# Altium schematic sheet Reprogrammable Timer.SchDoc
size A; SheetNumber: 1; SheetTotal: 1
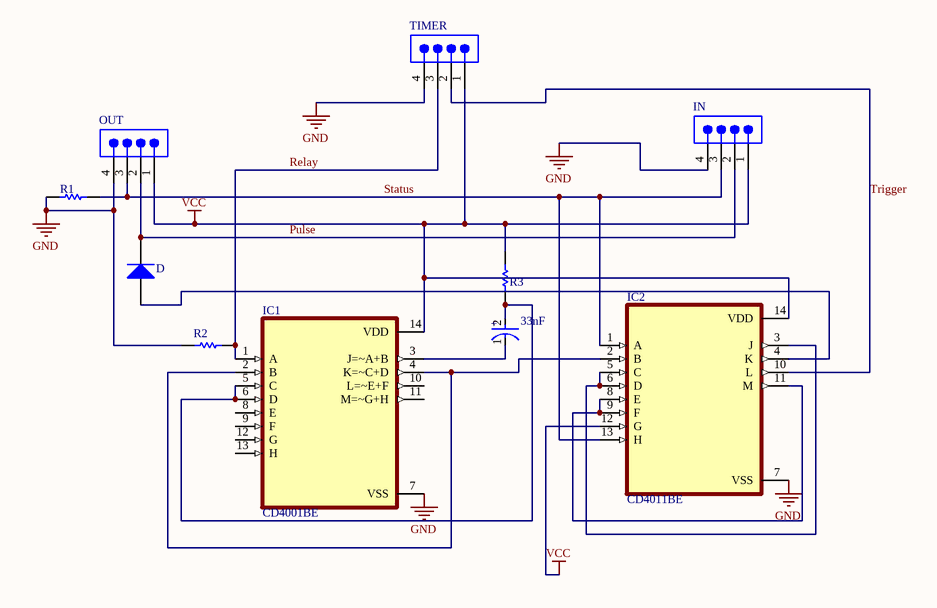
[diagram p0: Reprogrammable Timer.SchDoc]

## Parts
33nF  EEUHD1H330  [FP-RAD-TH-D_5_0_5-L_11_1-MFG]  (value not drawn)
D  1N4001-T  [DIOD-DO-41-P-2_V]  (value not drawn)
IC1  CD4001BE  [DIP794W45P254L1969H508Q14]
IC2  CD4011BE  [DIP794W45P254L1969H508Q14]
IN  TSW-104-08-L-S  [SMTC-TSW-104-08-X-S]  (value not drawn)
OUT  TSW-104-08-L-S  [SMTC-TSW-104-08-X-S]  (value not drawn)
R1  MFR-25FBF52-100K  [RESA60-630X240]  (value not drawn)
R2  MFR-25FBF52-100K  [RESA60-630X240]  (value not drawn)
R3  MFR-25FBF52-100K  [RESA60-630X240]  (value not drawn)
TIMER  TSW-104-08-L-S  [SMTC-TSW-104-08-X-S]  (value not drawn)

## Nets
GND: IC1.7(VSS) IC2.7(VSS) IN.4 OUT.4 R1.2 R2.1 TIMER.4
VCC: IC1.14(VDD) IC2.12(G) IC2.14(VDD) IN.1 OUT.1 R3.2 TIMER.1
Pulse: D.2(K) IN.2 OUT.2
Relay: IC1.1(A) R2.2 TIMER.3
Status: IC2.1(A) IC2.13(H) IN.3 OUT.3 R1.1
Trigger: IC2.10(L) TIMER.2
Net33nF_1: 33nF.1(C) IC1.3(J=~A+B)
Net33nF_2: 33nF.2(A) IC1.5(C) IC1.6(D) R3.1
NetD_1: D.1(A) IC2.4(K)
NetIC1_2: IC1.2(B) IC1.4(K=~C+D) IC2.2(B)
NetIC2_3: IC2.3(J) IC2.5(C) IC2.6(D)
NetIC2_8: IC2.8(E) IC2.9(F) IC2.11(M)

Not connected (* = marked no-connect by the designer): IC1 8(E) 9(F) 10(L=~E+F) 11(M=~G+H) 12(G) 13(H)

## Notes on the sheet
- (in symbol CMP-05427-001662-1) +

## Library data of the parts
33nF = CMP-05427-001662-1: Aluminum Electrolytic Capacitors (Radial Lead Type) AEC-Q200 Qualified 33uF ±20% 50V; Life (Hours): 1000Hour; Polarity: Polar; Ripple Current: 90mA; Lead/Base Style: Straight; Lead Diameter: 0.5mm; Height - Seated (Max): 0.492inch; REACH SVHC: No SVHC; Mount: Through Hole; Diameter: 5mm; Tolerance: 20%; Package Quantity: 200; Voltage Rating: 50V; Min Operating Temperature: -55°C; Series: HD; Length: 11mm; Voltage: 50V; Termination: Radial; Lead Pitch: 2.5mm; Capacitance: 33uF; Packaging: Bulk; Voltage Rating (DC): 50V; Case/Package: Radial; Max Operating Temperature: 105°C; Height: 11mm; Construction: RADIAL; RoHS Compliant: Yes; Ripple Current (AC): 90mA
D = CMP-0639-00006-2: 1.0 A Rectifier, 15 pF, 50 V, -65 to 150 degC, 2-Pin DO-41 Plastic, RoHS, Tape and Reel; Manufacturer: Diodes Inc; VF (V): 1; CT (pF): 15; Max. IR (uA): 5; VRRM (V): 50; Max. IFSM (A): 30; RoHS: TRUE; Mounting Technology: Through Hole; PartNumber: 1N4001-T; ComponentLink2Description: Datasheet; DatasheetVersion: Rev. 8-2; Operating Temperature Range (degC): -65 to 150; Packing: Tape and Reel; PackageReference: DO-41-P-2; ComponentLink1URL: http://diodes.com/; PackageDescription: 2-Pin Axial Lead, Body 4.635 x 2.36 mm, Lead Spread 25.4 mm; ComponentLink2URL: http://diodes.com/datasheets/ds28002.pdf; Max. Average Rectified Current IO (A): 1; ComponentLink1Description: Manufacturer URL
IC1 = CD4001BE: CMOS Quad 2-Input NOR Gate 14-PDIP -55 to 125; MF: Texas Instruments; Value: *; Texas_Instruments-Purchase-URL: https://snapeda.com/shop?store=Texas+Instruments&id=2748659; Availability: Unavailable; Price: None; MP: CD4001BE; Package: PDIP-14 Texas Instruments; DigiKey-Purchase-URL: https://snapeda.com/shop?store=DigiKey&id=2748659; SnapEDA_Link: https://www.snapeda.com/parts/CD4001BE/Texas%20Instruments/view-part/2748659/?ref=snap; Mouser-Purchase-URL: https://snapeda.com/shop?store=Mouser&id=2748659
IN OUT TIMER = CMP-1024-00358-1: 0.025" SQ Post Header, Through-hole, Vertical, -55 to 125 degC, 2.54 mm Pitch, 4-Pin, Male, RoHS; Manufacturer: Samtec; Pitch: 2.54 mm; PartNumber: TSW-104-08-L-S; RoHS: True; Temperature Range: -55 to 125 degC; PackageDescription: .025[0.64] SQ. Post Terminal Strip Assembly; Orientation: Vertical; ComponentLink2URL: http://www.samtec.com/documents/webfiles/pdf/TSW_TH.PDF; ComponentLink1Description: Manufacturer URL; ComponentLink2Description: Datasheet; PackageVersion: DM, 8/1988; ComponentLink3URL: http://www.samtec.com/documents/webfiles/cpdf/TSW-XXX-XX-XXX-X-XX-XXX-MKT.pdf; Mounting Technology: Through-hole; PackageReference: TSW-104-08-X-S; ComponentLink3Description: Package Specification; ComponentLink1URL: http://www.samtec.com; DatasheetVersion: F-214
R1-R3 = CMP-1659-00073-1: Axial Resistor, 100 KOhm, +/- 1%, 0.25 W, -55 to 155 degC, 2-Pin THD, RoHS, Bulk; Voltage Rating: 250 V; Power Rating: 250 mW; Resistance: 475 Ohm; PackageDescription: 2-Pin Axial Lead, Dia 2.4 mm, Body Length 6.3 mm; PackageReference: MFR-25; Length: 0.248 inch; ComponentLink2Description: Datasheet; Packaging: Bulk; DatasheetVersion: Apr-13; Package Quantity: 200; Min Operating Temperature: -55 degC; ComponentLink2URL: http://www.yageo.com/documents/recent/Yageo%20LR_MFR_2013.pdf; RoHSCompliant: true; ComponentLink1URL: http://www.yageo.com/; Tolerance: 1%; Case\Package: Axial; Mount: Through Hole; ComponentLink1Description: Manufacturer URL; Max Operating Temperature: 155 degC
IC2 = CD4011BE: Package: None; MP: CD4011BE; Value: *; Availability: Unavailable; Price: None